# EAGLE design bad_style (EAGLE 9.6.2)
Assembly variants: Minimal, FullAwesome
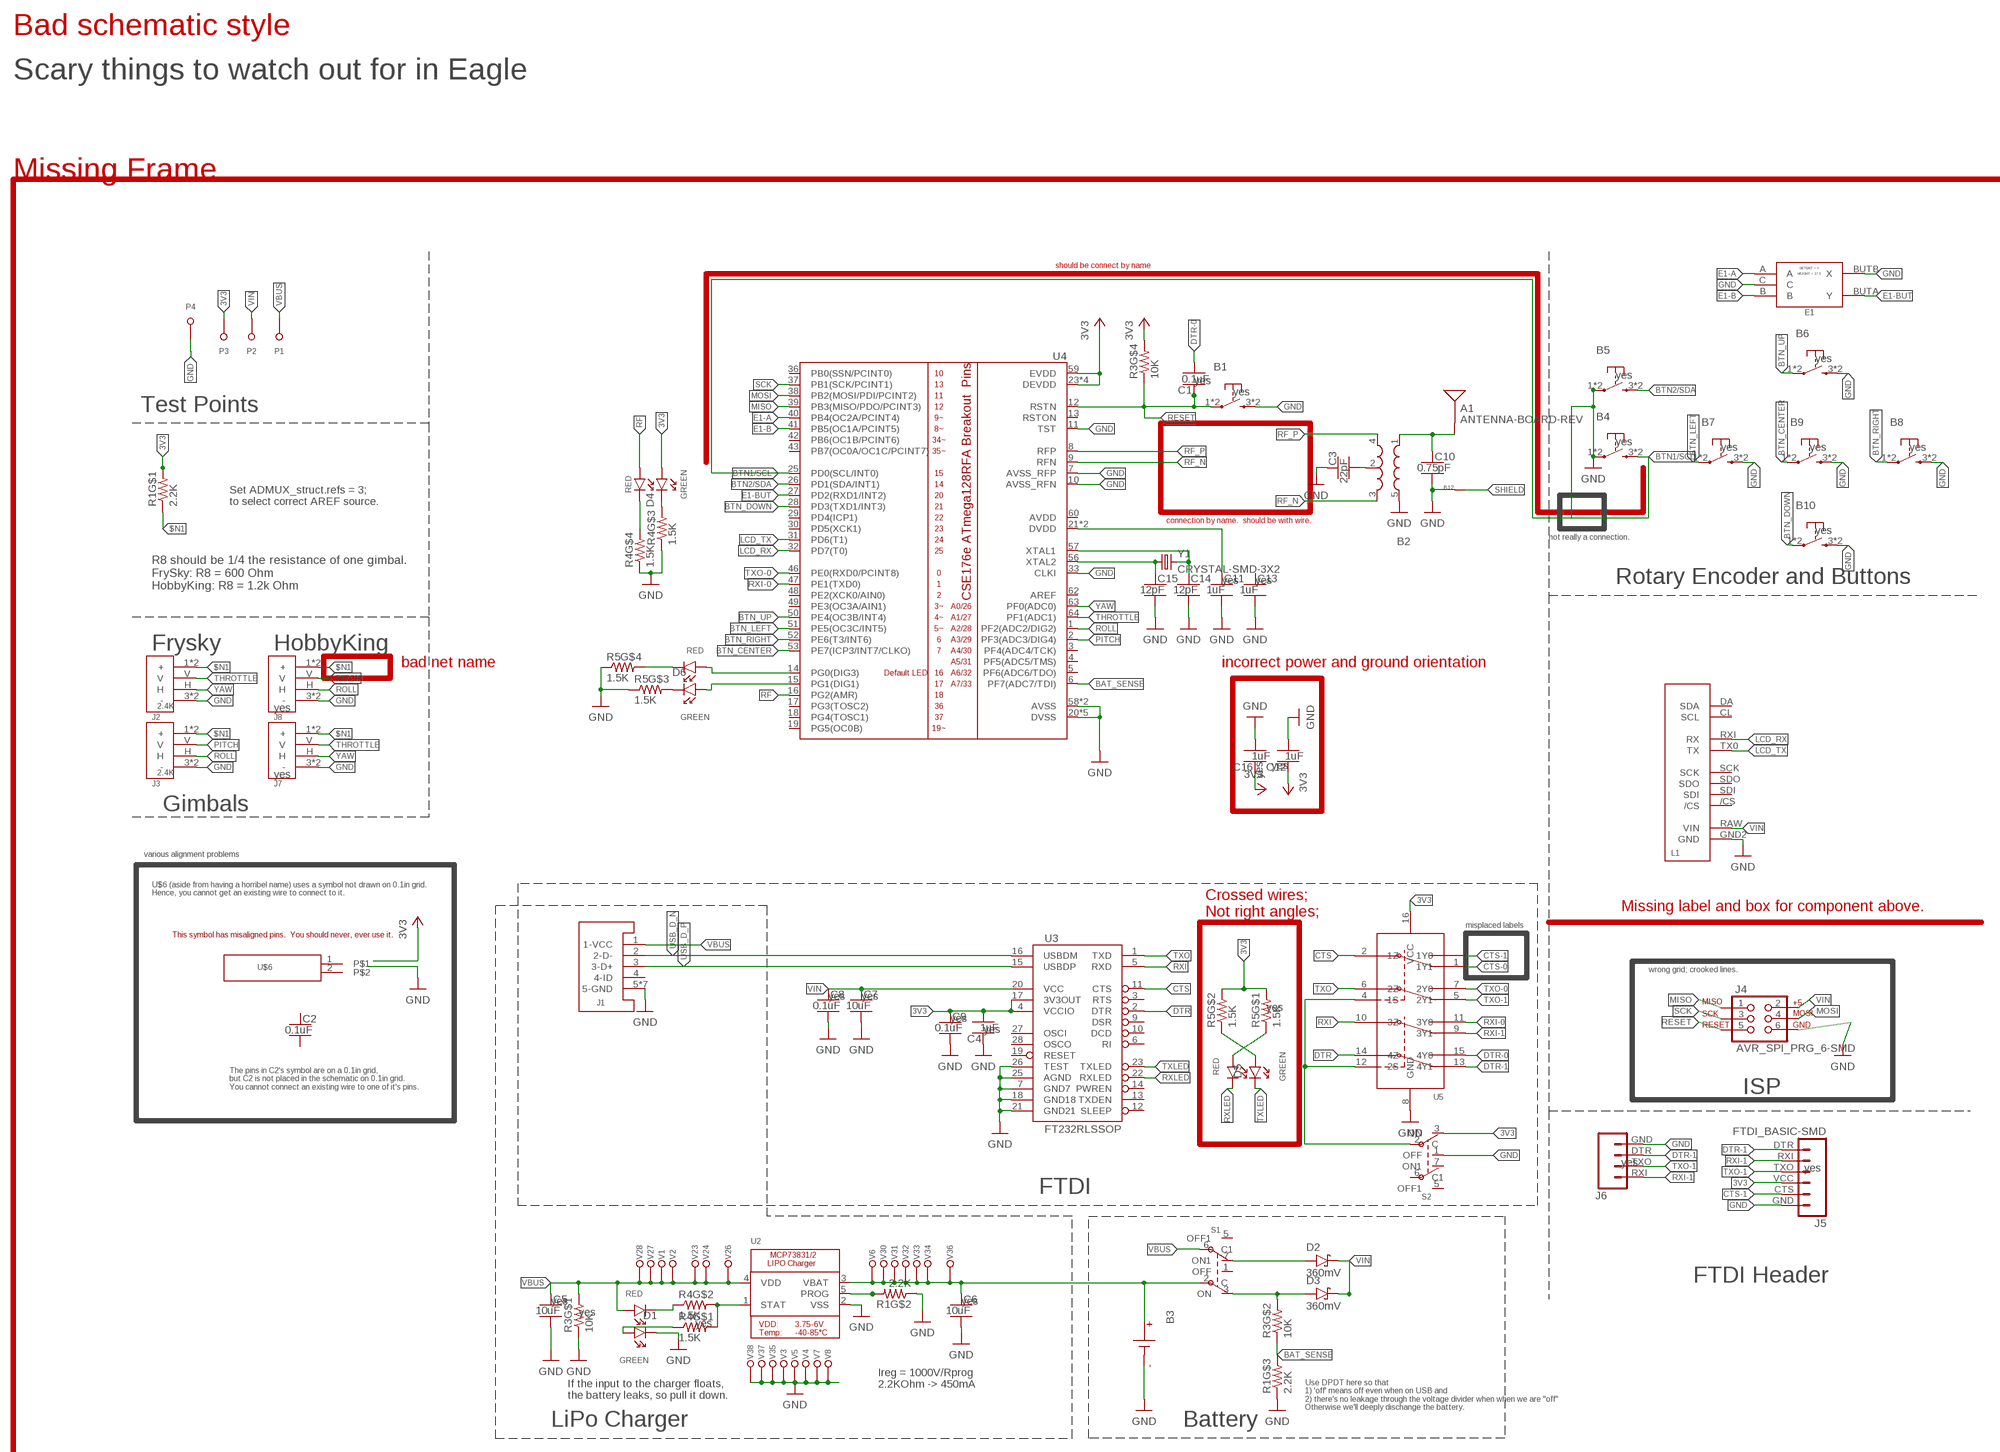
[diagram p0: schematic, sheet 1]

## Parts
A1  ANTENNA-BOARD-REV  [ANT_PCB_2.4GHZ_NRF8001_1.6MM_1OZ_REV]
B1  PUSHBUTTON_-4.5X4.5  [4.5MM_TACTILE_SWITCH_TL3305AF160QG]
B2  BALUN0805  [BALUN]
B3  BATTERY-SMD  [MOLEX-BATTERY-CONNECTOR-SMD-51005-2P]
B4  PUSHBUTTON_-4.5X4.5  [4.5MM_TACTILE_SWITCH_TL3305AF160QG]  (not fitted in variant Minimal)
B5  PUSHBUTTON_-4.5X4.5  [4.5MM_TACTILE_SWITCH_TL3305AF160QG]  (not fitted in variant Minimal)
B6  PUSHBUTTON_-4.5X4.5  [4.5MM_TACTILE_SWITCH_TL3305AF160QG]
B7  PUSHBUTTON_-4.5X4.5  [4.5MM_TACTILE_SWITCH_TL3305AF160QG]
B8  PUSHBUTTON_-4.5X4.5  [4.5MM_TACTILE_SWITCH_TL3305AF160QG]
B9  PUSHBUTTON_-4.5X4.5  [4.5MM_TACTILE_SWITCH_TL3305AF160QG]
B10  PUSHBUTTON_-4.5X4.5  [4.5MM_TACTILE_SWITCH_TL3305AF160QG]
B12  NET_BRIDGE  [NET_BRIDGE]
C1  0.1uF  CAPACITOR-NP_SMD-0603_CERAMIC-0.1UF  [CAPC1608X100]
C2  0.1uF  CAPACITOR-NP_SMD-0603_CERAMIC-0.1UF  [CAPC1608X100]
C3  22pF  CAPACITOR-NP_SMD-0603_CERAMIC-22PF  [CAPC1608X100]
C4  1uF  CAPACITOR-NP_SMD-0603_CERAMIC-1UF  [CAPC1608X100]
C5  10uF  CAPACITOR-NP_SMD-0603_CERAMIC-10UF  [CAPC1608X100]
C6  10uF  CAPACITOR-NP_SMD-0603_CERAMIC-10UF  [CAPC1608X100]
C7  10uF  CAPACITOR-NP_SMD-0603_CERAMIC-10UF  [CAPC1608X100]  (not fitted in variant Minimal)
C8  0.1uF  CAPACITOR-NP_SMD-0603_CERAMIC-0.1UF  [CAPC1608X100]  (not fitted in variant Minimal)
C9  0.1uF  CAPACITOR-NP_SMD-0603_CERAMIC-0.1UF  [CAPC1608X100]  (not fitted in variant Minimal)
C10  0.75pF  CAPACITOR-NP_SMD-0603_CERAMIC-0.75PF  [CAPC1608X100]
C11  1uF  CAPACITOR-NP_SMD-0603_CERAMIC-1UF  [CAPC1608X100]
C12  1uF  CAPACITOR-NP_SMD-0603_CERAMIC-1UF  [CAPC1608X100]
C13  1uF  CAPACITOR-NP_SMD-0603_CERAMIC-1UF  [CAPC1608X100]
C14  12pF  CAPACITOR-NP_SMD-0603_CERAMIC-12PF  [CAPC1608X100]
C15  12pF  CAPACITOR-NP_SMD-0603_CERAMIC-12PF  [CAPC1608X100]
C16  1uF  CAPACITOR-NP_SMD-0603_CERAMIC-1UF  [CAPC1608X100]
D1  LED-2X-GREEN/RED-1.6X1.5MM  [LED-2X-LITE-ON-1.6MMX1.5MM]
D2  360mV  DIODE-SCHOTTKY_-SMD-SOD123  [SODFL3516X96]
D3  360mV  DIODE-SCHOTTKY_-SMD-SOD123  [SODFL3516X96]
D4  LED-2X-GREEN/RED-1.6X1.5MM  [LED-2X-LITE-ON-1.6MMX1.5MM]
D5  LED-2X-GREEN/RED-1.6X1.5MM  [LED-2X-LITE-ON-1.6MMX1.5MM]  (not fitted in variant Minimal)
D6  LED-2X-GREEN/RED-1.6X1.5MM  [LED-2X-LITE-ON-1.6MMX1.5MM]
E1  ROTARY-ENCODER-W/BUTTON-BOURNS-PEC12R-4217F  [BOURNS-PEC12R]
J1  USB-MICROA-AMPHENOL-10118192-0001LF  [USB-MICROA-10118192-0001LF]  (not fitted in variant Minimal)
J2  2.4K  FRSKY-GIMBAL-FRYSKY  [JST-13-PTH]  (not fitted in variant Minimal)
J3  2.4K  FRSKY-GIMBAL-FRYSKY  [JST-13-PTH]  (not fitted in variant Minimal)
J4  AVR_SPI_PRG_6-SMD  [2X3-SMD]
J5  FTDI_BASIC-SMD  [FTDI-BASIC-SMD]
J6  FTDI-4PIN-RIGHT-ANGLE-SMD  [HEADER-2X2-0.1IN-MALE-RIGHT-ANGLE-SMD]
J7  FRSKY-GIMBAL-2X-SERVO-SMD  [2X-SERVO-SMD]
J8  FRSKY-GIMBAL-2X-SERVO-SMD  [2X-SERVO-SMD]
L1  SPARKFUN_SERLCD_SERIAL_REDUCED-SMD  [SPARKFUN_SERLCD_16X2_REDUCED_SMD]
P1  TEST-POINT  [TEST-POINT-KEYSTONE-5000]  (not fitted in variant Minimal)
P2  TEST-POINT  [TEST-POINT-KEYSTONE-5000]  (not fitted in variant Minimal)
P3  TEST-POINT  [TEST-POINT-KEYSTONE-5000]  (not fitted in variant Minimal)
P4  TEST-POINT  [TEST-POINT-KEYSTONE-5000]
R1  2.2K  RESISTOR-PACK-4X-2.2K  [RESCAXS50P200X100X45-8]
R3  10K  RESISTOR-PACK-4X-10K  [RESCAXS50P200X100X45-8]
R4  1.5K  RESISTOR-PACK-4X-1.5K  [RESCAXS50P200X100X45-8]
R5  1.5K  RESISTOR-PACK-4X-1.5K  [RESCAXS50P200X100X45-8]
S1  SWITCH-DPDT-300MA-6V-SMD  [JS202011JCQN]
S2  SWITCH-DPDT-300MA-6V-SMD  [JS202011JCQN]
U2  MCP73831T-2ACI/OT  MCP73831/2  [SOT23-5]
U3  FT232RLSSOP  [SSOP28DB]  (not fitted in variant Minimal)
U4  ATMEGA128RFA1  [QFN-64]
U5  DPDT-X2  [SOP65P640X110-16]  (not fitted in variant Minimal)
U$6  DONT_USE  [SCREW-TERMINAL-1X2-2.54MM]
V1  LOCKED-VIA-0.2  [VIA-0.2MM]
V2  LOCKED-VIA-0.2  [VIA-0.2MM]
V3  LOCKED-VIA-0.2  [VIA-0.2MM]
V4  LOCKED-VIA-0.2  [VIA-0.2MM]
V5  LOCKED-VIA-0.2  [VIA-0.2MM]
V6  LOCKED-VIA-0.2  [VIA-0.2MM]
V7  LOCKED-VIA-0.2  [VIA-0.2MM]
V8  LOCKED-VIA-0.2  [VIA-0.2MM]
V23  LOCKED-VIA-0.2  [VIA-0.2MM]
V24  LOCKED-VIA-0.2  [VIA-0.2MM]
V26  LOCKED-VIA-0.2  [VIA-0.2MM]
V27  LOCKED-VIA-0.2  [VIA-0.2MM]
V28  LOCKED-VIA-0.2  [VIA-0.2MM]
V30  LOCKED-VIA-0.2  [VIA-0.2MM]
V31  LOCKED-VIA-0.2  [VIA-0.2MM]
V32  LOCKED-VIA-0.2  [VIA-0.2MM]
V33  LOCKED-VIA-0.2  [VIA-0.2MM]
V34  LOCKED-VIA-0.2  [VIA-0.2MM]
V35  LOCKED-VIA-0.2  [VIA-0.2MM]
V36  LOCKED-VIA-0.2  [VIA-0.2MM]
V37  LOCKED-VIA-0.2  [VIA-0.2MM]
V38  LOCKED-VIA-0.2  [VIA-0.2MM]
Y1  CRYSTAL-SMD-3X2  [OSCCC320X250X85]

## Nets
3V3 [PWR]: C4.2 C9.1 C12.1 C16.1 D4.A1 J5.VCC P3.T R1.5 R3.8 R5.5 R5.6 S2.3(ON) U3.4(VCCIO) U3.17(3V3OUT) U4.23(DEVDD) U4.34(DEVDD) U4.44(DEVDD) U4.54(DEVDD) U4.59(EVDD) U5.16(VCC)
$N1: J2.1(+) J2.4(+) J3.1(+) J3.4(+) J7.1(+) J7.4(+) J8.1(+) J8.4(+) R1.4
ANTENNA [RFSIG]: A1.FEED(SIGNAL) B2.1(IN) C10.1
BAT_SENSE: R1.7 R3.3 U4.6(PF7(ADC7/TDI))
BCAP: B2.2(GND) C3.2
BPOS [HIGH-I]: B3.P C6.1 S1.2(C) U2.3(VBAT) V6.P1(N) V30.P1(N) V31.P1(N) V32.P1(N) V33.P1(N) V34.P1(N) V36.P1(N)
BTN1/SCL: B4.3 B4.4 U4.25(PD0(SCL/INT0))
BTN2/SDA: B5.3 B5.4 U4.26(PD1(SDA/INT1))
BTN_CENTER: B9.1 B9.2 U4.53(PE7(ICP3/INT7/CLKO))
BTN_DOWN: B10.1 B10.2 U4.28(PD3(TXD1/INT3))
BTN_LEFT: B7.1 B7.2 U4.51(PE5(OC3C/INT5))
BTN_RIGHT: B8.1 B8.2 U4.52(PE6(T3/INT6))
BTN_UP: B6.1 B6.2 U4.50(PE4(OC3B/INT4))
CLK_NEG: C15.1 U4.56(XTAL2) Y1.1
CLK_POS: C14.1 U4.57(XTAL1) Y1.3
CTS: U3.11(CTS) U5.2(1Z)
CTS-0: U5.3(1Y0)
CTS-1: J5.CTS U5.1(1Y1)
DTR: U3.2(DTR) U5.14(4Z)
DTR-0: C1.2 U5.15(4Y0)
DTR-1: J5.DTR J6.DTR U5.13(4Y1)
E1-A: E1.A U4.40(PB4(OC2A/PCINT4))
E1-B: E1.B U4.41(PB5(OC1A/PCINT5))
E1-BUT: E1.BUTA(Y) U4.27(PD2(RXD1/INT2))
GND [PWR]: B1.3 B1.4 B2.5(GND) B3.G2(N) B3.G3(N) B3.G(N) B4.1 B4.2 B5.1 B5.2 B6.3 B6.4 B7.3 B7.4 B8.3 B8.4 B9.3 B9.4 B10.3 B10.4 B12.P1 C3.1 C4.1 C5.2 C6.2 C7.2 C8.2 C9.2 C10.2 C11.2 C12.2 C13.2 C14.2 C15.2 C16.2 D1.C1 E1.BUTB(X) E1.C J1.5(5-GND) J1.6(5-GND) J1.7(5-GND) J1.8(5-GND) J1.9(5-GND) J1.10(5-GND) J1.11(5-GND) J2.3(-) J2.6(-) J3.3(-) J3.6(-) J4.6 J5.GND J6.GND J7.3(-) J7.6(-) J8.3(-) J8.6(-) L1.GND2(GND) P4.T R1.2 R1.3 R3.4 R4.1 R4.2 R5.1 R5.2 S2.1(OFF) U2.2(VSS) U3.7(GND7) U3.18(GND18) U3.21(GND21) U3.25(AGND) U3.26(TEST) U4.7(AVSS_RFP) U4.10(AVSS_RFN) U4.11(TST) U4.20(DVSS) U4.24(DVSS) U4.33(CLKI) U4.35(DVSS) U4.45(DVSS) U4.55(DVSS) U4.58(AVSS) U4.61(AVSS) U5.8(GND) V3.P1(N) V4.P1(N) V5.P1(N) V7.P1(N) V8.P1(N) V35.P1(N) V37.P1(N) V38.P1(N)
LCD_RX: L1.RXI(RX) U4.32(PD7(T0))
LCD_TX: L1.TX0(TX) U4.31(PD6(T1))
MISO: J4.1 U4.39(PB3(MISO/PDO/PCINT3))
MOSI: J4.4 U4.38(PB2(MOSI/PDI/PCINT2))
N$1: D1.A1 R4.4
N$2: D1.C2 R4.3
N$3: D5.A1 R5.3
N$4: D6.C2 R5.8
N$5: D6.C1 R5.7
N$6: D4.C1 R4.7
N$7: D5.A2 R5.4
N$8: D6.A2 U4.14(PG0(DIG3))
N$9: D6.A1 U4.15(PG1(DIG1))
N$11: R4.5 R4.6 U2.1(STAT)
N$12: R1.6 U2.5(PROG)
N$13: D4.C2 R4.8
N$14: D2.2(A) S1.7(ON1)
N$20: C11.1 U4.21(DVDD) U4.22(DVDD)
PITCH: J3.V J8.V U4.2(PF3(ADC3/DIG4))
PROG_SEL: S2.2(C) U5.4(1S) U5.12(2S)
RESET: B1.1 B1.2 C1.1 J4.5 R3.1 U4.12(RSTN)
RF: D4.A2 U4.16(PG2(AMR))
RF_N: B2.3(OUT2) U4.9(RFN)
RF_P: B2.4(OUT1) U4.8(RFP)
ROLL: J3.H J8.H U4.1(PF2(ADC2/DIG2))
RXI: U3.5(RXD) U5.10(3Z)
RXI-0: U4.47(PE1(TXD0)) U5.11(3Y0)
RXI-1: J5.RXI J6.RXI U5.9(3Y1)
RXLED: D5.C2 U3.22(RXLED)
SCK: J4.3 U4.37(PB1(SCK/PCINT1))
SHIELD: B12.P2
THROTTLE: J2.V J7.V U4.64(PF1(ADC1))
TXLED: D5.C1 U3.23(TXLED)
TXO: U3.1(TXD) U5.6(2Z)
TXO-0: U4.46(PE0(RXD0/PCINT8)) U5.7(2Y0)
TXO-1: J5.TXO J6.TXO U5.5(2Y1)
USB_D_N: J1.2(2-D-) U3.16(USBDM)
USB_D_P: J1.3(3-D+) U3.15(USBDP)
VBAT [HIGH-I]: D3.2(A) R3.6 S1.3(ON)
VBUS [HIGH-I]: C5.1 D1.A2 J1.1(1-VCC) P1.T R3.5 S1.6(C1) U2.4(VDD) V1.P1(N) V2.P1(N) V23.P1(N) V24.P1(N) V26.P1(N) V27.P1(N) V28.P1(N)
VIN [HIGH-I]: C7.1 C8.1 D2.1(C) D3.1(C) J4.2 L1.RAW(VIN) P2.T U3.20(VCC)
YAW: J2.H J7.H U4.63(PF0(ADC0))
Unconnected: C2.1 C2.2 C13.1 J1.4(4-ID) L1./CS L1.CL(SCL) L1.DA(SDA) L1.SCK L1.SDI L1.SDO R1.1 R1.8 R3.2 R3.7 S1.1(OFF) S1.5(OFF1) S2.5(OFF1) S2.6(C1) S2.7(ON1) U3.3(RTS) U3.6(RI) U3.9(DSR) U3.10(DCD) U3.12(SLEEP) U3.13(TXDEN) U3.14(PWREN) U3.19(RESET) U3.27(OSCI) U3.28(OSCO) U4.3(PF4(ADC4/TCK)) U4.4(PF5(ADC5/TMS)) U4.5(PF6(ADC6/TDO)) U4.13(RSTON) U4.17(PG3(TOSC2)) U4.18(PG4(TOSC1)) U4.19(PG5(OC0B)) U4.29(PD4(ICP1)) U4.30(PD5(XCK1)) U4.36(PB0(SSN/PCINT0)) U4.42(PB6(OC1B/PCINT6)) U4.43(PB7(OC0A/OC1C/PCINT7)) U4.48(PE2(XCK0/AIN0)) U4.49(PE3(OC3A/AIN1)) U4.60(AVDD) U4.62(AREF) U$6.1 U$6.2

## Notes on the sheet
- Bad schematic style
- Scary things to watch out for in Eagle
- Missing Frame
- should be connect by name
- Test Points
- connection by name.  should be with wire.
- Set ADMUX_struct.refs = 3;
  to select correct AREF source.
- not really a connection.
- Rotary Encoder and Buttons
- R8 should be 1/4 the resistance of one gimbal.
  FrySky: R8 = 600 Ohm
  HobbyKing: R8 = 1.2k Ohm
- Frysky | HobbyKing
- bad net name | incorrect power and ground orientation
- Gimbals
- various alignment problems
- U$6 (aside from having a horribel name) uses a symbol not drawn on 0.1in grid.  
  Hence, you cannot get an existing wire to connect to it.
- Missing label and box for component above.
- Crossed wires;
  Not right angles;
- misplaced labels
- wrong grid; crooked lines.
- The pins in C2's symbol are on a 0.1in grid,
  but C2 is not placed in the schematic on 0.1in grid.
  You cannot connect an existing wire to one of it's pins.
- ISP
- FTDI
- FTDI Header
- Ireg = 1000V/Rprog
  2.2KOhm -> 450mA
- If the input to the charger floats, 
  the battery leaks, so pull it down.
- Use DPDT here so that 
  1) 'off' means off even when on USB and 
  2) there's no leakage through the voltage divider when when we are "off"  
  Otherwise we'll deeply dischange the battery.
- LiPo Charger | Battery

## Library data of the parts
A1 = quadparts_prebuilt:ANTENNA: Single endded antenna.; CREATOR: Swanson; DESC: trace antenna; DIST: NA; DISTPN: NA; MFR: NA; MOUNTING: NONE; MPN: NA
B1 B4-B10 = quadparts_prebuilt:PUSHBUTTON_: "Tactile" or "clicky" button.; CREATOR: Swanson; DESC: SWITCH TACTILE SPST-NO 50MA 12V; DIST: DIGIKEY; DISTPN: EG5350CT-ND; MFR: E-Switch; MOUNTING: SMD; MPN: TL3305AF160QG; SUBSTITUTE_OK: yes
B2 = quadparts_prebuilt:BALUN: A balun to convert differential radio-frequency outputs from the microcontroller into a single-ended driver for the antenna.; CREATOR: Swanson; DATASHEET: http://katalog.we-online.de/pbs/datasheet/748421245.pdf; DESC: BALUN 2.4GHZ-2.5GHZ 50/100 0805; DIST: Digikey; DISTPN: 732-2230-1-ND; MFR: Wurth Electronics Inc.; MOUNTING: SMD; MPN: 748421245; PACKAGE: 0805; PRICE: 2.63; REVIEWER: Swanson
B3 = quadparts_prebuilt:BATTERY: Connections for a battery.; CREATOR: Swanson; DESC: Surface mount battery connector; DIST: ALIBABA; DISTPN: https://www.alibaba.com/product-detail/Molex-51005-51006-2-pin-female_60863668004.html?spm=a2700.7724857.normalList.97.20ef28e64nZnNK; MFR: UNKNOWN; MOUNTING: SMD; MPN: UNKNOWN
B12 = custom:NET_BRIDGE; CREATOR: Michael Gonzalez; DESC: NA; DIST: NA; DISTPN: NA; MFR: None; MFRPN: None; POPULATE: No
C1 C8 C9 = quadparts_prebuilt:CAPACITOR-NP_: Nonpolarized capacitor; CREATOR: Swanson; DESC: CAP CER 0.1UF 10V X7R 0603; DIST: Digikey; DISTPN: 399-1095-1-ND; MFR: KEMET; MOUNTING: SMD; MPN: C0603C104K8RACTU; PACKAGE: 0603; SUBSTITUTE_OK: yes
C2 = quadparts_prebuilt:CAPACITOR-NP_: Nonpolarized capacitor; CREATOR: Swanson; DESC: CAP CER 0.1UF 10V X7R 0603; DIST: Digikey; DISTPN: 399-1095-1-ND; MFR: KEMET; MOUNTING: SMD; MPN: C0603C104K8RACTU; PACKAGE: 0603
C3 = quadparts_prebuilt:CAPACITOR-NP_: Nonpolarized capacitor; CREATOR: Swanson; DESC: CAP CER 22PF 6.3V NP0 0603; DIST: Digikey; DISTPN: 478-11384-1-ND; MFR: AVX Corporation; MOUNTING: SMD; MPN: 06036A220KAT2A; PACKAGE: 0603
C4 C11-C13 C16 = quadparts_prebuilt:CAPACITOR-NP_: Nonpolarized capacitor; CREATOR: Swanson; DESC: CAP CER 1UF 10V X5R 0603; DIST: Digikey; DISTPN: 1276-1182-1-ND; MFR: Samsung Electro-Mechanics; MOUNTING: SMD; MPN: CL10A105KP8NNNC; PACKAGE: 0603; SUBSTITUTE_OK: yes
C5-C7 = quadparts_prebuilt:CAPACITOR-NP_: Nonpolarized capacitor; CREATOR: Swanson; DESC: CAP CER 10UF 6.3V X5R 0603; DIST: Digikey; DISTPN: 1276-1119-1-ND; MFR: Samsung Electro-Mechanics; MOUNTING: SMD; MPN: CL10A106MQ8NNNC; PACKAGE: 0603; SUBSTITUTE_OK: yes
C10 = quadparts_prebuilt:CAPACITOR-NP_: Nonpolarized capacitor; CREATOR: Swanson; DESC: CAP CER 0.75PF 50V NPO 0603; DIST: Digikey; DISTPN: 311-3843-1-ND; MFR: Yageo; MOUNTING: SMD; MPN: CC0603BRNPO9BNR75; PACKAGE: 0603
C14 C15 = quadparts_prebuilt:CAPACITOR-NP_: Nonpolarized capacitor; CREATOR: Swanson; DESC: CAP CER 12PF 10V C0G/NP0 0603; DIST: Digikey; DISTPN: 720-1655-1-ND; MFR: Vishay Vitramon; MOUNTING: SMD; MPN: VJ0603A120FXQCW1BC; PACKAGE: 0603
D1 D4-D6 = RemoteParts:LED-2X; COLOR1: RED; COLOR2: GREEN; CREATOR: Swanson; DESC: LED GREEN/RED CLEAR CHIP SMD; DIST: DIGIKEY; DISTPN: 160-2252-1-ND; MFR: Lite-On Inc.; MOUNTING: SMD; MPN: LTST-C195TGKRKT; PACKAGE: 4SMD
D2 D3 = quadparts_prebuilt:DIODE-SCHOTTKY_: Schottky diode; CREATOR: Swanson; DESC: DIODE SCHOTTKY 30V 1.5A SFLAT; DIST: Digikey; DISTPN: CRS08QMCT-ND; MFR: Toshiba Semiconductor and Storage; MOUNTING: SMD; MPN: CRS08(TE85L,Q,M); REVIEWER: Swanson
E1 = RemoteParts:ROTARY-ENCODER-W/BUTTON; AUX1DIST: DIGIKEY; AUX1DISTPN: 1722-1241-ND; CREATOR: Swanson; DETENT: Y; DIST: DIGIKEY; DISTPN: PEC12R-4217F-S0024-ND; HEIGHT: 17.5; MOUNTING: TH; POPULATE: NO
J1 = RemoteParts:USB; CREATOR: Swanson; DESC: CONN RCPT USB2.0 MICRO B SMD R/A; DIST: DIGIKEY; DISTPN: 609-4613-1-ND; MFR: Amphenol ICC (FCI); MOUNTING: SMD; MPN: 10118192-0001LF
J2 = RemoteParts:FRSKY-GIMBAL; CREATOR: Swanson; DESC: CONN HEADER VERT 12POS 2MM; DIST: Digikey; DISTPN: A100106-ND; MFR: TE Connectivity AMP Connectors; MOUNTING: TH; MPN: 1-1735446-2; POPULATE: NO
J3 = RemoteParts:FRSKY-GIMBAL; CREATOR: Swanson; DESC: CONN HEADER VERT 12POS 2MM; DIST: Digikey; DISTPN: A100106-ND; MFR: TE Connectivity AMP Connectors; MOUNTING: TH; MPN: 1-1735446-2; POPULATE: NO; SPICEPREFIX: E
J4 = quadparts_prebuilt:AVR_SPI_PRG_6: AVR ISP 6 Pin This is the in-system programming (ISP) connector for Atmel Microcontrollers programming.; CREATOR: Swanson; DESC: CONN HEADER SMD 6POS 2.54MM; DIST: Digikey; DISTPN: 609-3487-2-ND; MFR: Amphenol ICC (FCI); MOUNTING: SMD; MPN: 95278-101A06LF
J5 = quadparts_prebuilt:FTDI_BASIC: FTDI (USB-serial converter) header bins with labels.; CREATOR: Swanson; DESC: CONN HEADER SMD R/A 6POS 2.54MM; DIST: DIGIKEY; DISTPN: 952-3235-ND; LEFT_PIN: B; MFR: Harwin Inc.; MOUNTING: SMD; MPN: M20-8890645; RIGHT_PIN: G; SUBSTITUTE_OK: yes
J6 = quadparts_prebuilt:FTDI-4PIN; CREATOR: Swanson; DESC: CONN HEADER SMD R/A 4POS 2.54MM; DIST: DIGIKEY; DISTPN: SAM15344-ND; MFR: Samtec Inc.; MOUNTING: SMD; MPN: TSM-102-01-L-DH; SUBSTITUTE_OK: yes
J7 J8 = RemoteParts:FRSKY-GIMBAL; CREATOR: Swanson; DESC: CONN HEADER SMD R/A 6POS 2.54MM; DIST: DIGIKEY; DISTPN: 952-3235-ND; MFR: Harwin Inc.; MOUNTING: SMD; MPN: M20-8890645; SUBSTITUTE_OK: yes
L1 = RemoteParts:SPARKFUN_SERLCD_SERIAL_REDUCED; AUX1DIST: Sparkfun; AUX1DISTPN: LCD-14072; AUX1MFR: Sparkfun; AUX1MPN: LCD-14072; CREATOR: Swanson; DESC: 10 Position Header, Top or Bottom Entry Connector Surface Mount; DIST: Digikey; DISTPN: S5641-ND; MFR: Sullins Connector Solutions; MOUNTING: SMD; MPN: NPPC101KFXC-RC
P1 = RemoteParts:TEST-POINT; CREATOR: Swanson; DESC: PC TEST POINT MINIATURE BLACK; DIST: DIGIKEY; DISTPN: 36-5001-ND; MFR: Keystone Electronics; MOUNTING: TH; MPN: 5001; POPULATE: no
P2-P4 = RemoteParts:TEST-POINT; CREATOR: Swanson; DESC: PC TEST POINT MINIATURE BLACK; DIST: DIGIKEY; DISTPN: 36-5001-ND; MFR: Keystone Electronics; MOUNTING: TH; MPN: 5001; POPULATE: NO
R1 = quadparts_prebuilt:RESISTOR-PACK-4X; CREATOR: Swanson; DESC: RES ARRAY 4 RES 220 OHM 0804; DIST: DIGIKEY; DISTPN: Y10222CT-ND; MFR: Panasonic Electronic Components; MOUNTING: SMD; MPN: EXB-N8V221JX; SUBSTITUTE_OK: yes
R3 = quadparts_prebuilt:RESISTOR-PACK-4X; CREATOR: Swanson; DESC: RES ARRAY 4 RES 10K OHM 0804; DIST: DIGIKEY; DISTPN: Y10103CT-ND; MFR: Panasonic Electronic Components; MOUNTING: SMD; MPN: EXB-N8V103JX; PACKAGE: 0804; SUBSTITUTE_OK: yes
R4 R5 = quadparts_prebuilt:RESISTOR-PACK-4X; CREATOR: Swanson; DESC: RES ARRAY 4 RES 1.5K OHM 0804; DIST: DIGIKEY; DISTPN: Y10152CT-ND; MFR: Panasonic Electronic Components; MOUNTING: SMD; MPN: EXB-N8V152JX; SUBSTITUTE_OK: yes
S1 S2 = RemoteParts:SWITCH-DPDT; CREATOR: Swanson; DESC: SWITCH SLIDE DPDT 300MA 6V; DIST: DIGIKEY; DISTPN: CKN10723CT-ND; MFR: C&K; MOUNTING: SMD; MPN: JS202011JCQN
U2 = RemoteParts:MCP73831/2: MCP73831/2 LIPO Charger VDD: 3.75 - 6V Temp -40 - 85°C Programmable Charge Rate: 15-500mA NOTE: STAT is a tri-state logic output on the MCP73831 and an open-drain output on the MCP73832. SOT23-5 with 4.2V output and tri-state logic on STAT = MCP73831T-2ACI/OT; CREATOR: Adafruit; DESC: IC CONTROLLR LI-ION 4.2V SOT23-5; DIST: DIGIKEY; DISTPN: MCP73831T-2ACI/OTCT-ND; MFR: Microchip Technology; MOUNTING: SMD; MPN: MCP73831T-2ACI/OT; PACKAGE: SOT23-5
U3 = RemoteParts:FT232RL: USB UART FT232RL 4th Generation USB UART (USB <-> Serial) Controller. Spark Fun Electronics SKU : COM-00650; CREATOR: Swanson; DESC: IC USB FS SERIAL UART 28-SSOP; DIST: DIGIKEY; DISTPN: 768-1007-1-ND; MFR: FTDI; MOUNTING: SMD; MPN: FT232RL-REEL
U4 = quadparts_prebuilt:ATMEGA128RFA1: ATmega128RFA1 8-bit AVR Microcontroller with Low Power 2.4GHz Transceiver for ZigBee and IEEE 802.15.4; CREATOR: Swanson; DATASHEET: http://www.atmel.com/Images/Atmel-8266-MCU_Wireless-ATmega128RFA1_Datasheet.pdf; DESC: IC RF TXRX+MCU 802.15.4 64VFQFN; DIST: Digikey; DISTPN: ATMEGA128RFA1-ZU-ND; MFR: Microchip Technology; MOUNTING: SMD; MPN: ATMEGA128RFA1-ZU; PACKAGE: QFN; PRICE: 10.21; REVIEWER: Swanson
U5 = RemoteParts:DPDT-X2; CREATOR: Swanson; DESC: IC ANALOG SWITCH DPDT 16TSSOP; DIST: DIGIKEY; DISTPN: 568-5300-1-ND; MFR: NXP USA Inc.; MOUNTING: SMD; MPN: NX3L2467PW,118
U$6 = RemoteParts:DONT_USE
V1-V8 V23 V24 V26-V28 V30-V38 = quadparts_prebuilt:LOCKED-VIA: A via that be removed via ripup.; CREATOR: Swanson; DIST: NA; DISTPN: NA; MFR: NA; MFRPN: NA; MOUNTING: NONE; POPULATE: NO
Y1 = quadparts_prebuilt:CRYSTAL: Crystals to provide clock references for microcontrollers, etc.; CREATOR: Swanson; DESC: CRYSTAL 16.0000MHZ 18PF SMD; DIST: DIGIKEY; DISTPN: 535-9134-1-ND; MFR: Abracon LLC; MOUNTING: SMD; MPN: ABM8-16.000MHZ-B2-T

## Net classes
1 HIGH-I: width 0.508 mm, drill 0.381 mm
2 RFSIG: width 1.016 mm

## Board
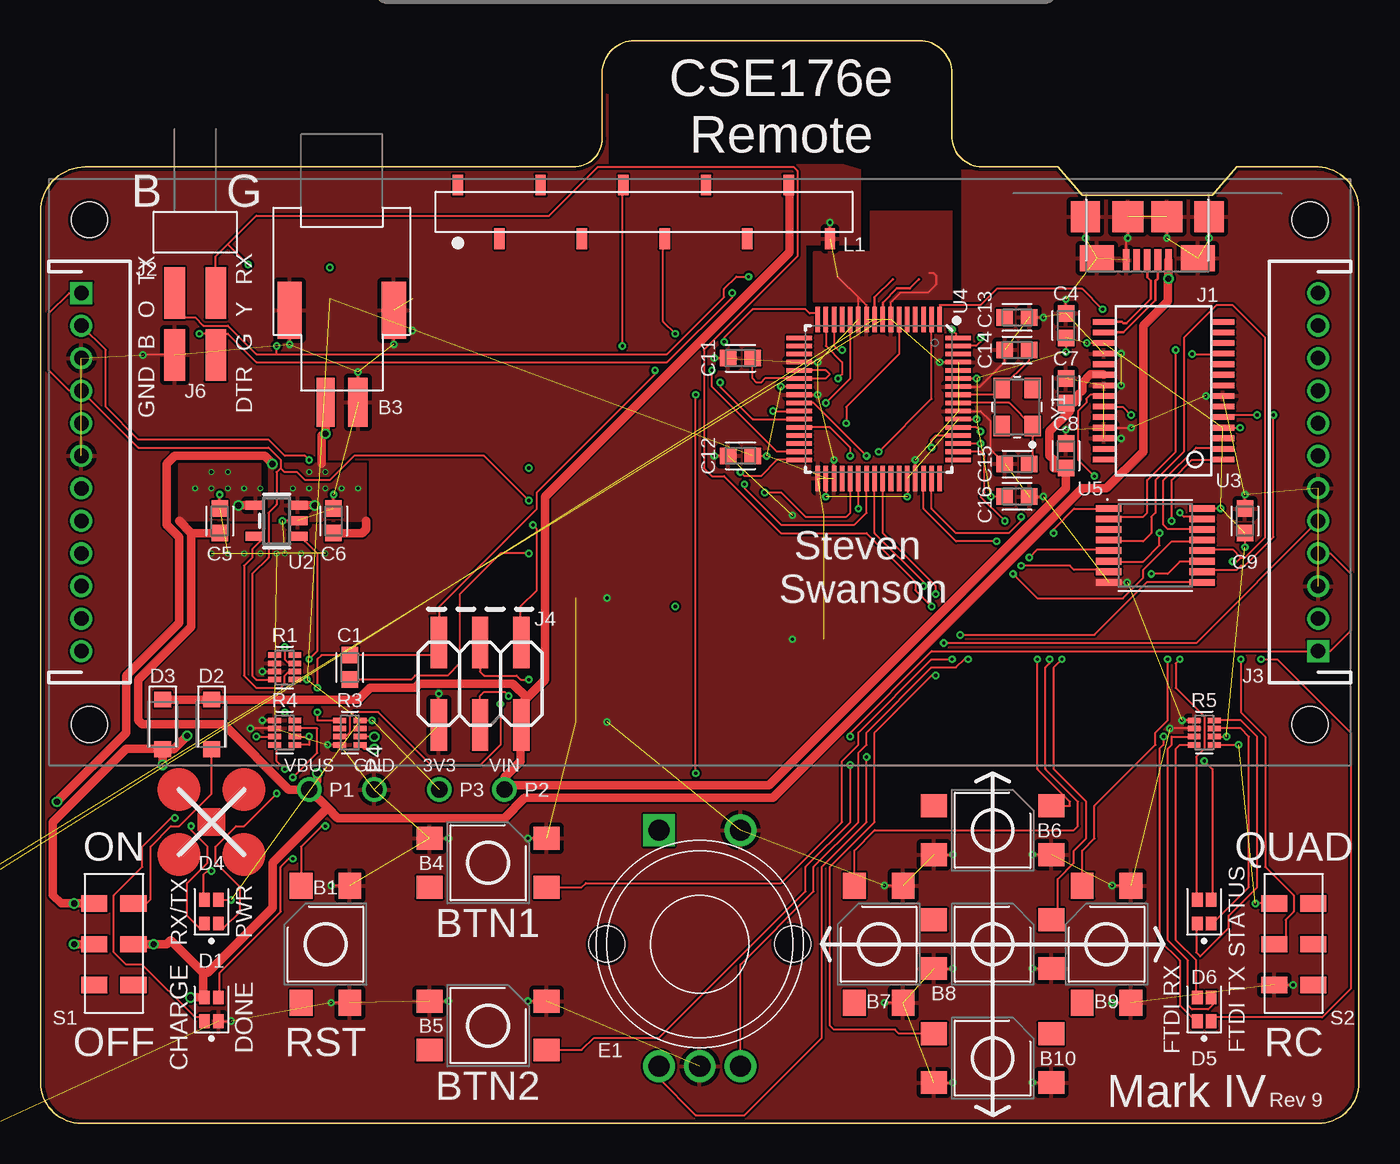
[diagram p1: board, top side]
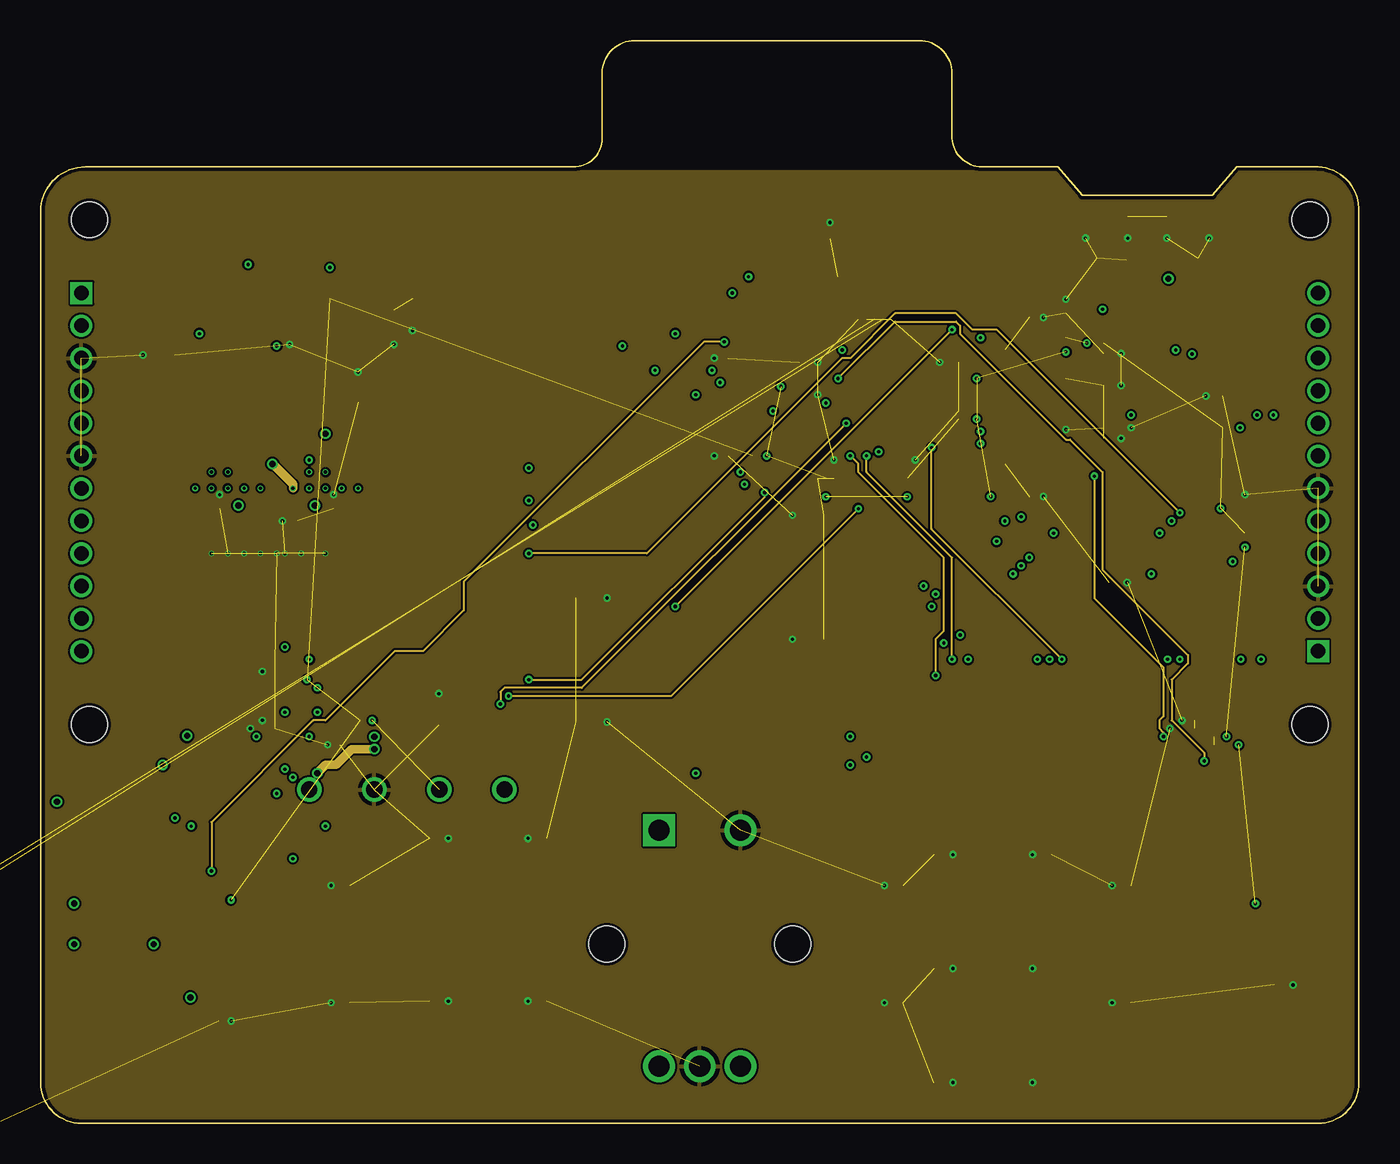
[diagram p2: board, inner layer Route2]
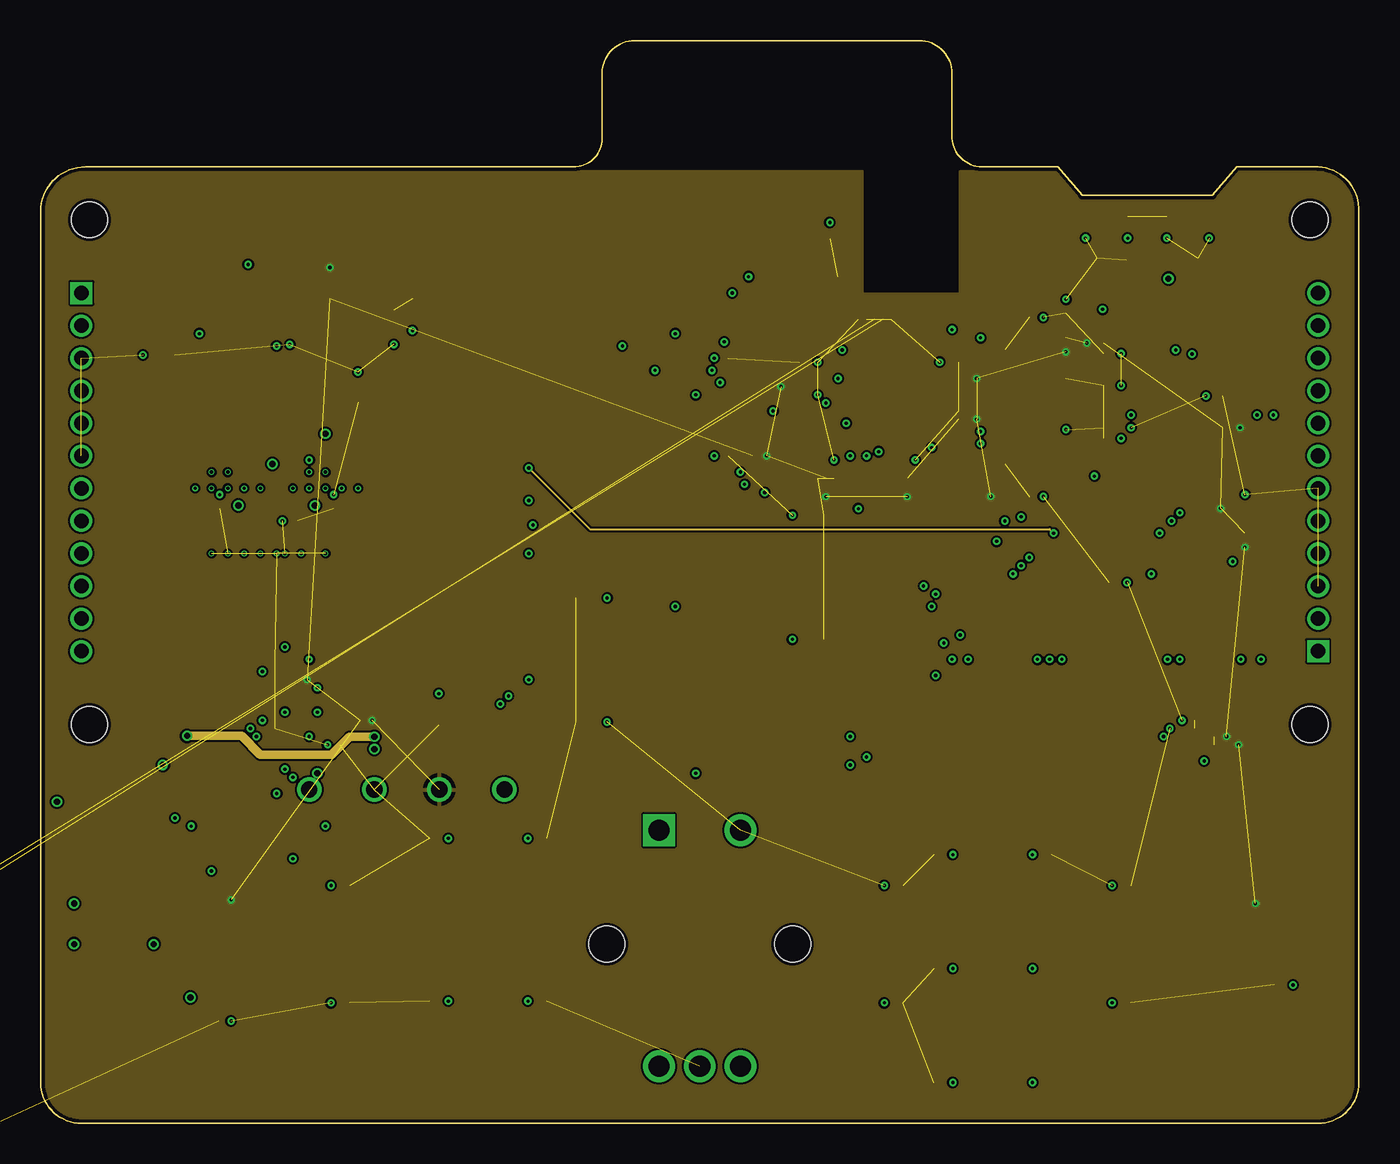
[diagram p3: board, inner layer Route15]
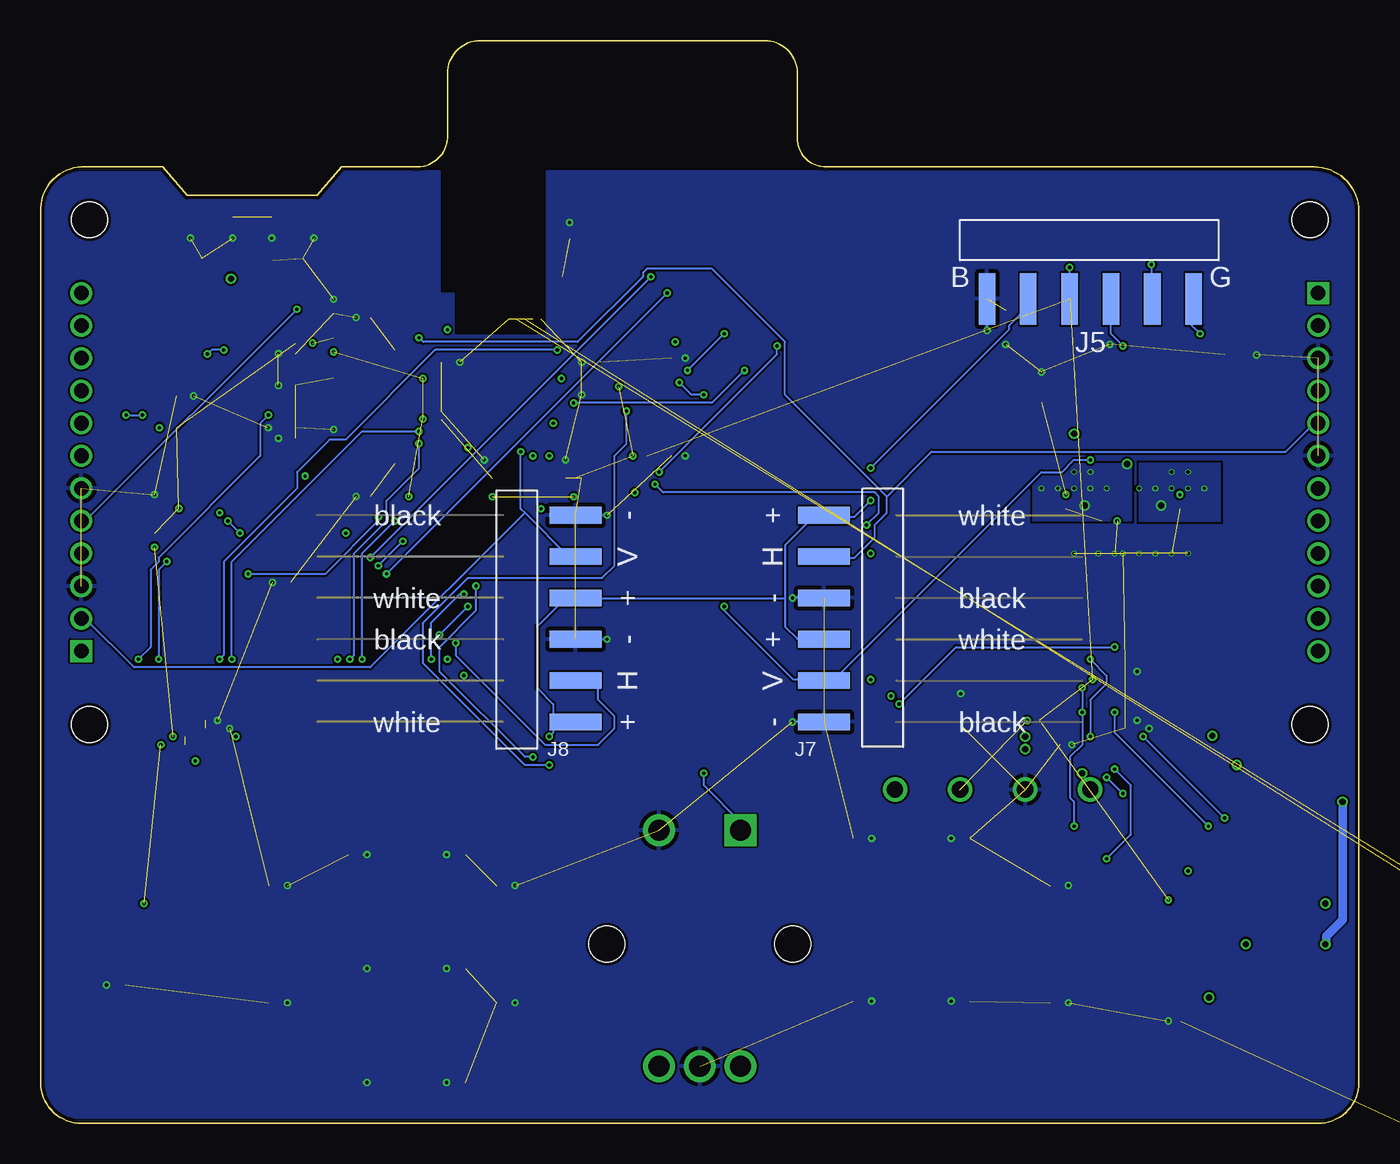
[diagram p4: board, bottom side, seen from below]

Size 81 x 66.5 mm. Coordinates in mm from the lower left corner, seen from the top.
Outline: 2.5,0 78.5,0 arc90 81,2.5 81,56 arc90 78.5,58.75 73.5,58.75 72,57 64,57 62.5,58.75 58,58.75 arc-90 56,60.5 56,64.5 arc90 54,66.5 36.5,66.5 arc90 34.5,64.5 34.5,60.5 arc-90 32.75,58.75 2.75,58.75 arc90 0,56 0,2.5 arc90 2.5,0
Copper layers (1*2*15*16): Top 0.035559375mm / dielectric 1.501140625mm / Route2 0.035559375mm / dielectric 0.149859375mm / Route15 0.035559375mm / dielectric 0.200659375mm / Bottom 0.035559375mm
Design rules "jlcpcb-4layer-5mil-small-cream": minimum track width 5mil, minimum drill 0.2mm, track to track 5mil, track to pad 5mil, pad to pad 5mil, via to via 5mil, smd to smd 5mil, copper to edge 0.2mm, drill to drill 10mil, minimum pad ring 3mil, minimum via ring 5mil, stop-mask expansion 3mil, vias tented up to drill 0.45mm, thermal gap 10mil
tRestrict: 12 lines
bRestrict: area 35,48.5 to 55.5,66.5

### Footprints (pad centres in the part's own frame; a part is rotated, then mirrored left to right if it is on the bottom)
ANT_PCB_2.4GHZ_NRF8001_1.6MM_1OZ_REV = smd 1.27 x 1.27: FEED 0,0; TESTPOINT 8.169,17.605
4.5MM_TACTILE_SWITCH_TL3305AF160QG = smd 1.6 x 1.4: 1 -3.6,-1.5; 2 3.6,-1.5; 3 -3.6,1.5; 4 3.6,1.5
BALUN = smd 0.35 x 1: 1 -0.65,-0.8; 2 0,-0.8; 3 0.65,-0.8; 4 0.65,0.8; 5 0,0.8; 6 -0.65,0.8
MOLEX-BATTERY-CONNECTOR-SMD-51005-2P = smd 1.2 x 3: G -1,5.2 | smd 1.5 x 3.5: G2 -3.2,-0.45; G3 3.2,-0.45 | smd 1.1 x 3: P 1,5.2
NET_BRIDGE = drill 0.2 pad 0.813: P1 -0.5,0; P2 0.5,0
CAPC1608X100 = smd 1.009 x 1.015: 1 -0.753,0; 2 0.753,0
LED-2X-LITE-ON-1.6MMX1.5MM = smd 0.85 x 0.65: A1 -0.725,0.425; A2 -0.725,-0.425; C1 0.725,0.425; C2 0.725,-0.425
SODFL3516X96 = smd 0.962 x 1.029: 1 -1.525,0; 2 1.525,0
BOURNS-PEC12R = drill 1.3: A -2.5,-7.5; B 2.5,-7.5; BUTB 2.5,7; C 0,-7.5 | drill 1.3 square: BUTA -2.5,7 | hole 2.2: -5.7,0; 5.7,0
FRSKY-TARANIS-GIMBAL = hole 2.2: -27,-27; -27,27; -27,27; 27,-27; 27,27
USB-MICROA-10118192-0001LF = smd 0.4 x 1.35: 1 -1.3,0; 2 -0.65,0; 3 0,0; 4 0.65,0; 5 1.3,0 | smd 2.1 x 1.6: 6 3.1,-0.125; 7 -3.1,-0.125 | smd 1.8 x 1.9: 8 -3.8,-2.675; 11 3.8,-2.675 | smd 1.9 x 1.9: 9 1.2,-2.675; 10 -1.2,-2.675
JST-13-PTH = drill 0.9 square: 1 -2,0 | drill 0.9: 3 2,0; 4 4,0; 6 8,0; 7 10,0; 8 12,0; 9 14,0; 10 16,0; 11 18,0; 12 20,0; H 6,0; V 0,0
2X3-SMD = smd 1 x 3.15: 1 -2.54,-2.54; 2 -2.54,2.54; 3 0,-2.54; 4 0,2.54; 5 2.54,-2.54; 6 2.54,2.54
FTDI-BASIC-SMD = smd 1.02 x 3.17: CTS -3.81,0.635; DTR 6.35,0.635; GND -6.35,0.635; RXI 3.81,0.635; TXO 1.27,0.635; VCC -1.27,0.635
HEADER-2X2-0.1IN-MALE-RIGHT-ANGLE-SMD = smd 1.27 x 3.18: DTR 1.27,-8.806; GND -1.27,-8.806; RXI 1.27,-4.996; TXO -1.27,-4.996
2X-SERVO-SMD = smd 1.02 x 3.17: 1 -6.35,0.635; 3 -1.27,0.635; 4 1.27,0.635; 6 6.35,0.635; H -3.81,0.635; V 3.81,0.635
SPARKFUN_SERLCD_16X2_REDUCED_SMD = smd 0.635 x 1.27: /CS -7.24,14.336; CL 0.38,17.636; DA 2.92,14.336; GND2 8,14.336; RAW 5.46,17.636; RXI -4.7,17.636; SCK -14.86,17.636; SDI -9.78,17.636; SDO -12.32,14.336; TX0 -2.16,14.336 | hole 2.2: -37.5,-15.5; -37.5,15.5; 37.5,-15.5; 37.5,15.5
TEST-POINT-KEYSTONE-5000 = drill 1: T 0,0
RESCAXS50P200X100X45-8 = smd 0.79 x 0.339: 1 -0.62,0.75; 2 -0.62,0.25; 3 -0.62,-0.25; 4 -0.62,-0.75; 5 0.62,-0.75; 6 0.62,-0.25; 7 0.62,0.25; 8 0.62,0.75
JS202011JCQN = smd 1 x 1.6: 1 -2.5,1.2; 2 0,1.2; 3 2.5,1.2; 5 -2.5,-1.2; 6 0,-1.2; 7 2.5,-1.2
SOT23-5 = smd 0.55 x 1.2: 1 -0.95,-1.3; 2 0,-1.3; 3 0.95,-1.3; 4 0.95,1.3; 5 -0.95,1.3
SSOP28DB = smd 0.348 x 1.397: 1 -4.225,-3.656; 2 -3.575,-3.656; 3 -2.925,-3.656; 4 -2.275,-3.656; 5 -1.625,-3.656; 6 -0.975,-3.656; 7 -0.325,-3.656; 8 0.325,-3.656; 9 0.975,-3.656; 10 1.625,-3.656; 11 2.275,-3.656; 12 2.925,-3.656; 13 3.575,-3.656; 14 4.225,-3.656; 15 4.225,3.656; 16 3.575,3.656; 17 2.925,3.656; 18 2.275,3.656; 19 1.625,3.656; 20 0.975,3.656; 21 0.325,3.656; 22 -0.325,3.656; 23 -0.975,3.656; 24 -1.625,3.656; 25 -2.275,3.656; 26 -2.925,3.656; 27 -3.575,3.656; 28 -4.225,3.656
QFN-64 = smd 1.562 x 0.28: 1 -4.881,3.75; 2 -4.881,3.25; 3 -4.881,2.75; 4 -4.881,2.25; 5 -4.881,1.75; 6 -4.881,1.25; 7 -4.881,0.75; 8 -4.881,0.25; 9 -4.881,-0.25; 10 -4.881,-0.75; 11 -4.881,-1.25; 12 -4.881,-1.75; 13 -4.881,-2.25; 14 -4.881,-2.75; 15 -4.881,-3.25; 16 -4.881,-3.75; 33 4.881,-3.75; 34 4.881,-3.25; 35 4.881,-2.75; 36 4.881,-2.25; 37 4.881,-1.75; 38 4.881,-1.25; 39 4.881,-0.75; 40 4.881,-0.25; 41 4.881,0.25; 42 4.881,0.75; 43 4.881,1.25; 44 4.881,1.75; 45 4.881,2.25; 46 4.881,2.75; 47 4.881,3.25; 48 4.881,3.75 | smd 0.28 x 1.562: 17 -3.75,-4.881; 18 -3.25,-4.881; 19 -2.75,-4.881; 20 -2.25,-4.881; 21 -1.75,-4.881; 22 -1.25,-4.881; 23 -0.75,-4.881; 24 -0.25,-4.881; 25 0.25,-4.881; 26 0.75,-4.881; 27 1.25,-4.881; 28 1.75,-4.881; 29 2.25,-4.881; 30 2.75,-4.881; 31 3.25,-4.881; 32 3.75,-4.881; 49 3.75,4.881; 50 3.25,4.881; 51 2.75,4.881; 52 2.25,4.881; 53 1.75,4.881; 54 1.25,4.881; 55 0.75,4.881; 56 0.25,4.881; 57 -0.25,4.881; 58 -0.75,4.881; 59 -1.25,4.881; 60 -1.75,4.881; 61 -2.25,4.881; 62 -2.75,4.881; 63 -3.25,4.881; 64 -3.75,4.881
SOP65P640X110-16 = smd 1.572 x 0.407: 1 -2.872,2.275; 2 -2.872,1.625; 3 -2.872,0.975; 4 -2.872,0.325; 5 -2.872,-0.325; 6 -2.872,-0.975; 7 -2.872,-1.625; 8 -2.872,-2.275; 9 2.872,-2.275; 10 2.872,-1.625; 11 2.872,-0.975; 12 2.872,-0.325; 13 2.872,0.325; 14 2.872,0.975; 15 2.872,1.625; 16 2.872,2.275
SCREW-TERMINAL-1X2-2.54MM = drill 1.1 square: 1 -1.27,0 | drill 1.1: 2 1.27,0
VIA-0.2MM = drill 0.2 pad 0.3: P1 0,0
OSCCC320X250X85 = smd 1.262 x 1.012: 1 -1.175,-0.95; 2 1.175,-0.95; 3 1.175,0.95; 4 -1.175,0.95

### Placement (x,y rotation side)
A1  -116.5,-64 0 top  (outside the outline)
B1  17.5,11 270 top
B2  -105.5,-48 0 top  (outside the outline)
B3  18.5,49.5 180 top
B4  27.5,16 180 top
B5  27.5,6 180 top
B6  58.5,18 180 top
B7  51.5,11 270 top
B8  58.5,11 180 top
B9  65.5,11 270 top
B10  58.5,4 180 top
B12  -106.5,-67 0 top  (outside the outline)
C1  19,28 270 top
C2  -108.5,-42 0 top  (outside the outline)
C3  -110.5,-68 0 top  (outside the outline)
C4  63,49 270 top
C5  11,37 90 top
C6  18,37 90 top
C7  63,45 90 top
C8  63,41 90 top
C9  74,37 90 top
C10  -115.5,-68 0 top  (outside the outline)
C11  43,47 180 top
C12  43,41 180 top
C13  60,49.5 0 top
C14  60,47.5 180 top
C15  60,40.5 180 top
C16  60,38.5 0 top
D1  10.5,7 270 top
D2  10.5,24.5 270 top
D3  7.5,24.5 270 top
D4  10.5,13 270 top
D5  71.5,7 270 top
D6  71.5,13 270 top
E1  40.5,11 0 top
E$1  [FRSKY-TARANIS-GIMBAL]  -39.5,30 0 top  (outside the outline)
E$2  [FRSKY-TARANIS-GIMBAL]  120.5,30 180 top  (outside the outline)
J1  68,53 180 top
J2  2.5,49 270 top
J3  78.5,31 90 top
J4  27,27 180 top
J5  16.5,50 0 bottom
J6  9.5,56 0 top
J7  33.5,31 270 bottom
J8  47.5,31 90 bottom
L1  40.5,40 0 top
P1  16.5,20.5 90 top
P2  28.5,20.5 90 top
P3  24.5,20.5 90 top
P4  20.5,20.5 0 top
R1  15,28 0 top
R3  19,24 0 top
R4  15,24 0 top
R5  71.5,24 0 top
S1  4.5,11 90 top
S2  77,11 90 top
U2  14.5,37 90 top
U3  69,45 90 top
U4  51.5,44.5 270 top
U5  68.5,35.5 0 top
U$1  [700MAH-BATTERY]  77,-25.5 90 top  (outside the outline)
U$2  [QUADCLASS_LOGO_SMALL]  10.5,18.5 0 top
U$3  [LAYER_LABELS]  39.5,-12 0 top  (outside the outline)
U$4  [375MAH-BATTERY]  -31.5,32 0 top  (outside the outline)
U$5  [600MAH-BATTERY]  41.5,82 90 top  (outside the outline)
U$6  -114.5,-38 0 top  (outside the outline)
V1  11.5,39 180 top
V2  11.5,40 180 top
V3  12.5,35 0 top
V4  17.5,35 180 top
V5  15,35 0 top
V6  17.5,39 180 top
V7  10.5,35 180 top
V8  14.5,35 180 top
V23  13.5,39 180 top
V24  9.5,39 180 top
V26  12.5,39 180 top
V27  10.5,40 180 top
V28  10.5,39 180 top
V30  17.5,40 180 top
V31  18.5,39 180 top
V32  19.5,39 180 top
V33  15.5,39 180 top
V34  16.5,40 180 top
V35  11.5,35 180 top
V36  16.5,39 180 top
V37  16,35 180 top
V38  13.5,35 180 top
Y1  60,44 90 top

### Tracks (layer width: path | path; a pad name or v marks a point on that pad's centre or on a via)
3V3  (via drill 0.2)  (19 unrouted)
  Top 0.127: C4.2 v63,47.39 | S2.3 v74.65,13.5 | R3.8 v20.37,24.75 | U3.17 v64.29,47.92 | U3.4 v73.71,42.73 | C9.1 v74,35.38 | U4.23 v45.48,45.25 | U4.59 v57.52,45.75 | U4.54 v57.52,43.25 | U4.44 v53.25,38.48 | U4.34 v48.25,38.48 | R1.5 v16.37,27.25 | C16.1 v58.39,38.5 | C12.1 v44.62,41 | D4.A1 v11.7,13.73 | R5.6 v72.87,23.75 | R5.5 v73.61,23.25 | U5.16 v72.51,37.77
  Bottom 0.127: J5.VCC v17.77,52.57
  pour Route15 (rank 2): -5.5,64.49 32,64.49 32,58.5 50.5,58.5 50.5,51 56.5,51 56.5,58.5 58,58.5 58,64.5 86.5,64.5 86.5,-1.5 -5.5,-1.5
$N1  (via drill 0.2)
  Top 0.127: R1.4 13.25,27.25 13,27.5 13,33.75 14,34.75 14,37.5 14.5,38 14.5,40 14.75,40.25 | 14.75,40.25 14.75,40.75 14,41.5 6,41.5 J2.4 1.75,45 0.5,46.25 0.5,49.75 1.75,51 J2.1 | J3.4 79.25,35 80.5,33.75 80.5,30.25 79.25,29 J3.1 54.75,29 49.75,24 v49.75,23.75 | 14.75,40.25 15,40 15.75,40 16.25,39.5 17.75,39.5 19.25,41 27.25,41 v30,38.25
  Bottom 0.127: 35.25,32.25 35.25,35.5 33.5,37.25 33,37.25 J7.1 32.75,37.25 31,37.25 v30,38.25 | 35.25,32.25 35.25,30.5 34.5,29.75 33,29.75 J7.4 | 49.5,25 49.25,24.75 48.25,24.75 J8.1 49.5,25 | 49.5,25 49.5,25.75 50.5,26.75 50.5,30.5 48.75,32.25 48.25,32.25 J8.4 48,32.25 35.25,32.25 | v49.75,23.75 49.5,24 49.5,25
ANTENNA  (2 unrouted)
BAT_SENSE  (via drill 0.2)
  Top 0.127: R3.3 18.75,23.75 19,24 19,25 19.25,25.25 20.75,25.25 24,22 27,22 28.25,23.25 v28.25,25.75 | v49.5,43 49.5,44 52.75,47.25 U4.6 | R1.7 15.25,28.25 15,28.5 v15,29.25
  Route2 0.127: v28.25,25.75 28.25,26.5 28.5,26.75 33.25,26.75 v49.5,43
  Bottom 0.127: v15,29.25 24.75,29.25 v28.25,25.75
BCAP  (1 unrouted)
BPOS  (via drill 0.38)
  Top 0.508: U2.3 v16.84,37.95 | S1.2 v2.06,11 | B3.P v17.5,42.36 17.25,42.25 17.25,40.5 | 20,37 20,36.5 19.75,36.25 C6.1 | v1,19.75 5.25,24 5.25,27.5 8.5,30.75 8.5,36 7.75,36.75 7.75,40.5 8.25,41 13.75,41 v14.25,40.5 v14.24,40.5
  Route2 0.508: v14.24,40.5 15.5,39.24 V33.P1
  Bottom 0.508: v1,19.75 1,12.5 2,11.5 2,11 v2.06,11
  pour Top: 14,37 20,37 20,40.5 14,40.5
  pour Bottom (rank 2): 14,37 20,37 20,40.5 14,40.5
BTN1/SCL  (via drill 0.2)
  Top 0.127: U4.25 47.5,44.25 v50.75,41 | v56,28.5 54.75,28.5 50.25,24 50.25,23.25 49.25,22.25 49.25,18.5 45.5,14.75 33.5,14.75 33.25,14.5 B4.3
  Route2 0.127: v50.75,41 50.75,40 56,34.75 v56,28.5
BTN2/SDA  (via drill 0.2)
  Top 0.127: v45,43.75 U4.26 | v49.75,22 49.75,18.5 47,15.75 47,14.25 38,5.25 34,5.25 33.25,4.5 B5.3
  Bottom 0.127: v45,43.75 45,41.75 45.75,41 45.75,34.25 46.5,33.5 54.75,33.5 57.5,30.75 57.5,28.25 51.25,22 v49.75,22
BTN_CENTER  (via drill 0.2)
  Top 0.127: U4.53 57.5,42.75 v57.75,42.5 | v69.25,28.5 69.25,24.75 68.5,24 68.5,23.25 64.75,19.5 64.75,17.5 64,16.75 B9.1
  Bottom 0.127: v57.75,42.5 61.25,42.5 69.25,34.5 v69.25,28.5
BTN_DOWN  (via drill 0.2)
  Top 0.127: U4.28 48.5,42.75 49.75,41.5 v49.75,41 | v55,27.5 54.75,27.5 51.25,24 51.25,18.5 48.5,15.75 48.5,6 48.75,5.75 52.5,5.75 52.75,5.5 B10.2
  Route2 0.127: v49.75,41 50.25,40.5 50.25,40 55.5,34.75 55.5,30.25 55,29.75 v55,27.5
BTN_LEFT  (via drill 0.2)
  Top 0.127: v57.75,41.75 U4.51 | v62,28.5 62,28.25 61.75,28 61.75,21.75 63.75,19.75 63.75,18.25 63.5,18 51.25,18 50,16.75 B7.1
  Bottom 0.127: v57.75,41.75 57.75,40.25 59.75,38.25 59.75,37 61.75,35 61.75,28.75 v62,28.5
BTN_RIGHT  (via drill 0.2)
  Top 0.127: U4.52 55,42.25 54.75,42 v54.75,41.5 | v62.75,28.5 62.25,28 62.25,21.75 64.25,19.75 64.25,17.5 63.5,16.75 63.5,16 62.5,15 62.5,12.5 B8.1
  Route2 0.127: v54.75,41.5 54.75,36.5 v62.75,28.5
BTN_UP  (via drill 0.2)
  Top 0.127: U4.50 57.75,41.25 58,41 58,38.75 57.75,38.5 v59.25,37 | v61.25,28.5 61.25,21.75 63.25,19.75 63.25,19.5 B6.1
  Bottom 0.127: v59.25,37 61.25,35 v61.25,28.5
CLK_NEG
  Top 0.127: U4.56 59.52,44.25 Y1.1 60.95,40.7 C15.1
CLK_POS
  Top 0.127: U4.57 58.62,44.75 Y1.3 60.75,46.88 C14.1
CTS  (via drill 0.2)
  Top 0.127: v70.75,47.25 72.5,47.25 U3.11 | v69.75,47.5 69.75,41.25 68,39.5 68,37.5 67.75,37.25 65.75,37.25 U5.2
  Bottom 0.127: v70.75,47.25 70.5,47.5 v69.75,47.5
CTS-1  (via drill 0.2)
  Top 0.127: v62.25,36.25 62.25,36.5 63.5,37.75 65.5,37.75 U5.1
  Route15 0.127: v62.25,36.25 62,36.5 33.75,36.5 v30,40.25
  Bottom 0.127: v30,40.25 21.5,48.75 21.5,49 20.25,50.25 20.25,50.5 J5.CTS
DTR
  Top 0.127: U3.2 72.5,41.5 71,41.5 69,39.5 69,36.75 69.25,36.5 71.25,36.5 U5.14
DTR-0  (via drill 0.2)
  Top 0.127: v30,35 28.25,35 25.75,32.5 25.75,28.25 25,27.5 23,27.5 22.75,27.25 C1.2 | v70,37.5 70.25,37.25 71.25,37.25 U5.15
  Route2 0.127: v30,35 37.25,35 49.25,47 49.75,47 52.5,49.75 56.25,49.75 57.25,48.75 58.75,48.75 v70,37.5
DTR-1  (via drill 0.2)
  Top 0.127: v59.75,33.75 61.25,32.25 66.5,32.25 67.75,33.5 67.75,34 69.5,35.75 71.25,35.75 U5.13 | v42.5,51 42.5,50.75 38.5,46.75 13.25,46.75 11.5,48.5 10.75,48.5 | 10.75,48.5 10.75,47.25 J6.DTR 10.75,48.5 | 10.75,48.5 v9.75,48.5
  Bottom 0.127: v42.5,51 v59.75,33.75 | v9.75,48.5 10.25,49 10.25,50.5 J5.DTR
E1-A  (via drill 0.2)
  Top 0.127: U4.40 51.25,36.25 54.25,33.25 v54.25,33 | v50.75,22.5 50.75,18.5 48,15.75 48,5.25 43.25,0.5 40.25,0.5 38,2.75 E1.A
  Bottom 0.127: v54.25,33 54.25,31.5 56.5,29.25 56.5,27.75 51.25,22.5 v50.75,22.5
E1-B  (via drill 0.2)
  Top 0.127: U4.41 51.75,36.25 55,33 v55,32.5 | v57,28.5 56.75,28.5 56.25,28 54.75,28 50.75,24 50.75,23.25 50.25,22.75 50.25,18.5 47.5,15.75 47.5,14.25 43,9.75 E1.B
  Bottom 0.127: v55,32.5 55.25,32.5 57,30.75 v57,28.5
E1-BUT  (via drill 0.2)
  Top 0.127: U4.27 43.75,43.25 41.75,45.25 v41.75,45.5 | v40.25,21.5 v40.25,44.75
  Bottom 0.127: v41.75,45.5 41,44.75 v40.25,44.75 | v40.25,21.5 40.25,20.75 38,18.5 E1.BUTA
GND  (via drill 0.2)  (79 unrouted)
  Top 0.127: U4.10 50.75,50.25 50.25,50.75 | 48.97,52 49.67,51.3 49.7,51.3 50.25,50.75 | U4.11 50.25,50.75 | U4.7 52.25,50.45 52.82,51.02 54.52,51.02 55,51.5 55,52.09 54.88,52.22 54.59,52.22 | U4.55 57.75,43.75 58.35,43.15 58.35,41.39 C15.2 | U4.58 57.72,45.25 59.25,46.78 C14.2 | U4.20 v47.75,46.75 | U4.24 v47.75,44.75 | U4.61 v55.25,46.75 | U4.45 v53.75,40.75 | U4.35 v48.75,40.75 | U3.26 v66.4,42.08 | U3.25 v67.02,42.73 | U3.21 v66.4,45.33 | U3.18 v66.4,47.27 | U3.7 v71.6,44.67 | B7.3 v51.85,14.6 | B7.4 v51.85,7.4 | B3.G v19.5,46.15 | B3.G2 v21.7,47.85 | B3.G3 v15.3,47.85 | J1.8 v71.8,54.37 | J1.10 v69.2,54.37 | J1.9 66.8,54.5 | 66.8,54.5 v66.8,54.37 | J1.11 v64.2,54.37 | B6.4 v56.05,16.5 | B6.3 v60.95,16.5 | J4.6 v24.46,26.39 | B10.4 v56.05,2.5 | B10.3 v60.95,2.5 | B8.4 v56.05,9.5 | B8.3 v60.95,9.5 | S2.1 v76.95,8.5 | B1.3 v17.85,14.6 | B1.4 v17.85,7.4 | B9.3 v65.85,14.6 | B9.4 v65.85,7.4 | L1.GND2 v48.5,55.33 | B5.2 v25.05,7.5 | B5.1 v29.95,7.5 | U2.2 v14.85,37 | B4.2 v25.05,17.5 | B4.1 v29.95,17.5 | U5.8 v66.77,33.23 | R5.1 v70.13,24.75 | R5.2 v69.39,24.25 | C12.2 v41.38,41 | C16.2 v61.61,38.5 | C9.2 v74,38.62 | R3.4 v17.63,23.25 | J6.GND v6.29,47.19 | C4.1 v63,50.61 | C5.2 v11,38.62 | C6.2 v18,38.62 | R4.1 v13.63,24.75 | R4.2 v12.89,24.25 | C8.2 v63,42.62 | C11.2 v41.38,47 | D1.C1 v11.7,6.27 | C13.2 v61.61,49.5 | R1.3 v13.63,27.75 | 66.8,54.5 66.7,54.4 J1.5
  Bottom 0.127: J5.GND v22.85,48.7 | J7.3 v34.8,32.27 | J7.6 v34.8,24.65 | J8.3 v46.2,29.73 | J8.6 v46.2,37.35
  pour Bottom: 20,36.5 8.5,36.5 8.5,34 20,34
  pour Top (rank 2): 32,64 -5,64 -5,-1 86,-1 86,64 58,64 58,58.5 56.5,58.5 56.5,50 47,50 47,54 50.5,54 50.5,58.5
  pour Route2: 32,65 32,58.5 58,58.5 58,65 87,65 87,-2 -6,-2 -6,65
  pour Bottom (rank 4): 32,65.5 -6.5,65.5 -6.5,-2.5 87.5,-2.5 87.5,65.5 58,65.5 58,58.5 56.5,58.5 56.5,51 50.5,51 50.5,58.5 32,58.5
  pour Top: 56,50.5 56,56 51,56 51,53.5 47.5,53.5 47.5,50.5
LCD_RX  (via drill 0.2)
  Top 0.127: v35.75,47.75 35.75,57.5 L1.RXI | v43,40 43.25,39.75 44.25,39.75 45.25,40.75 U4.32
  Bottom 0.127: v35.75,47.75 35.75,47.25 v43,40
LCD_TX  (via drill 0.2)
  Top 0.127: v39,48.5 38.25,49.25 38.25,54.25 L1.TX0 | v41.25,46.25 41.25,45.25 45.25,41.25 U4.31
  Bottom 0.127: v41.25,46.25 v39,48.5
MISO  (via drill 0.2)
  Top 0.127: U4.39 50.75,37.5 50,36.75 45.5,36.75 43.25,39 v43.25,39.25 | v30.25,36.75 30.5,36.5 30.5,32.75 29.5,31.75 29.5,29.75 J4.1
  Bottom 0.127: v43.25,39.25 42.75,38.75 29.75,38.75 29.5,38.5 29.5,37.5 v30.25,36.75
MOSI  (via drill 0.2)
  Top 0.127: v50.25,37.75 U4.38 | v28.75,26.25 28.5,26.5 27.25,26.5 27,26.25 J4.4
  Route2 0.127: v50.25,37.75 38.75,26.25 v28.75,26.25
N$1  (via drill 0.2)
  Top 0.127: v15,21.75 14.5,22.25 14.5,23.25 R4.4 | v15.5,16.25 15.25,16.25 14.75,15.75 14.75,13 11,9.25 11,7.75 D1.A1
  Bottom 0.127: v15,21.75 14,20.75 14,17.75 v15.5,16.25
N$2  (via drill 0.2)
  Top 0.127: v13.25,23.75 R4.3 | v8.25,18.75 8,18.75 6.25,17 6.25,15.75 4.5,14 4.5,10.5 5.25,9.75 6.25,9.75 9.5,6.5 10,6.5 D1.C2
  Bottom 0.127: v8.25,18.75 v13.25,23.75
N$3
  Top 0.127: R5.3 69.5,23.75 69.5,23.25 69.25,23 69.25,11.25 70.5,10 70.5,7.25 70.75,7 71.75,7 72,7.25 72,7.5 D5.A1
N$4
  Top 0.127: R5.8 73.75,24.75 74.75,23.75 74.75,14.5 73,12.75 73,12 71.25,10.25 71,10.5 71,12.25 D6.C2
N$5
  Top 0.127: R5.7 73.75,24.25 74.25,23.75 74.25,14.5 72,12.25 D6.C1
N$6  (via drill 0.2)
  Top 0.127: R4.7 17,24.25 17,22.75 v15.5,21.25 | v14.5,20.25 12.5,18.25 12,18.25 10.75,17 10.75,16 12.25,14.5 12.25,13 11.25,12 11,12 10.75,12.25 D4.C1
  Bottom 0.127: v14.5,20.25 v15.5,21.25
N$7
  Top 0.127: R5.4 70,23.25 69.75,23 69.75,11.25 71,10 71,7.75 D5.A2
N$8  (via drill 0.2)
  Top 0.127: v70,28.5 69.75,28.25 69.75,26.75 71.5,25 71.5,23 71,22.5 71,13.75 D6.A2 | v49.25,47.5 49,47.5 48.75,47.75 U4.14
  Bottom 0.127: v70,28.5 69.75,28.75 69.75,34.5 65.25,39 65.25,40 63.25,42 62.25,42 56.75,47.5 v49.25,47.5
N$9  (via drill 0.2)
  Top 0.127: v71.5,22.25 72,21.75 72,13.75 D6.A1 | v49,45.75 49.25,46 49.25,46.75 48.25,47.75 U4.15
  Route2 0.127: v71.5,22.25 71.5,22.75 69.5,24.75 69.5,27.25 70.5,28.25 70.5,28.75 65.25,34 65.25,40 63.25,42 63,42 56.5,48.5 56.5,49 56.25,49.25 52.5,49.25 v49,45.75
N$11  (via drill 0.2)
  Top 0.127: R4.5 16.5,23.25 v16.5,23.75 R4.6 | v16.5,28.5 17,29 17,35 16.25,35.75 16.25,36 16,36.25 U2.1
  Bottom 0.127: v16.5,23.75 16.5,26 15.5,27 15.5,27.5 v16.5,28.5
N$12
  Top 0.127: R1.6 15.25,27.75 15,27.5 15,27 14.75,26.75 13.25,26.75 12.5,27.5 12.5,34.25 13,34.75 13,35.25 13.5,35.75 13.5,36 13.25,36.25 U2.5
N$13  (via drill 0.2)
  Top 0.127: v15,25.25 15.5,24.75 R4.8 | v9.25,18.25 9.25,18 10.25,17 10.25,16 9,14.75 9,12.75 9.75,12 10,12 10.25,12.25 D4.C2
  Bottom 0.127: v15,25.25 15,24 v9.25,18.25
N$14
  Top 0.127: D2.2 10.5,20.25 8.5,18.25 8,18.25 6.75,17 6.75,13.75 6.5,13.5 S1.7
N$20
  Top 0.127: C11.1 43.75,45.75 44,45.5 44.25,45.5 44.5,45.75 U4.22 48.25,45.75 48.5,46 48.25,46.25 U4.21
PITCH  (via drill 0.2)
  Top 0.127: U4.2 54.75,44.5 v51.5,41.25
  Bottom 0.127: v51.5,41.25 51.5,37.75 51.25,37.5 | 51.25,37.5 48.5,34.75 48.25,34.75 J8.V | J3.V 78.25,31 75.25,28 60.75,28 51.25,37.5
PROG_SEL  (via drill 0.2)
  Top 0.127: 73.75,34.75 74,34.75 75.25,36 75.25,48.25 73.25,50.25 72.25,50.25 70.25,48.25 70.25,41.25 68.5,39.5 68.5,37.5 68.25,37.25 68.25,36.25 67.75,35.75 65.75,35.75 U5.4 | 73.75,34.75 73.25,35.25 71.5,35.25 U5.12 | S2.2 76.5,11 76.5,12.5 77,13 77,14 75.25,15.75 75.25,23.75 73.75,25.25 v73.75,28.5 | v73.25,34.5 73.5,34.5 73.75,34.75
  Bottom 0.127: v73.75,28.5 73.75,34 v73.25,34.5
RESET  (via drill 0.2)
  Top 0.127: R3.1 17,24.75 v17,25.25 | v17,26.75 17,28.5 17.25,28.75 C1.1 | U4.12 49.75,45.75 v48.25,44.25 | v37.75,46.25 37.75,46 30.5,38.75 30.5,37.75 24.5,31.75 24.5,29.75 J4.5 24.5,29.5 24.5,29 24.25,28.75 C1.1 | C1.1 | B1.1 16,17 17.25,18.25 v17.5,18.25
  Bottom 0.127: v17,26.75 v17,25.25 17,23.25 17.75,22.5 17.75,20 17.5,19.75 v17.5,18.25 | v48.25,44.25 39.75,44.25 v37.75,46.25
RF  (via drill 0.2)
  Top 0.127: v10.5,15.5 10.25,15.5 10,15.25 10,13.75 D4.A2 | v42,48 42,48.25 43.75,50 47,50 47.25,49.75 47.75,49.75 U4.16
  Route2 0.127: v10.5,15.5 10.5,18.5 16.75,24.75 17.5,24.75 21.75,29 23.5,29 26,31.5 26,33.25 40.75,48 v42,48
RF_N  (1 unrouted)
  Top 0.152: U4.9 51.25,50.73 52.38,51.85
RF_P  (1 unrouted)
  Top 0.152: U4.8 51.75,50.41 52.63,51.28 53.41,51.28 53.98,51.85
ROLL  (via drill 0.2)
  Top 0.127: U4.1 55.25,50.25 57.75,50.25 58.75,51.25 64,51.25 v65.25,50 | v55.5,29.5 71,29.5 J3.H
  Bottom 0.127: v65.25,50 78.25,37 J3.H | v55.5,29.5 55.5,28.75 50,23.25 46.75,23.25 45.75,24.25 45.75,25 46.75,26 46.75,27 47,27.25 48,27.25 J8.H
RXI  (via drill 0.2)
  Top 0.127: v74.75,43.5 72.75,43.5 U3.5 | v75.75,43.5 75.75,36 74,34.25 73.75,34.25 73.5,34 71.5,34 U5.10
  Bottom 0.127: v75.75,43.5 v74.75,43.5
RXI-0  (via drill 0.2)
  Top 0.127: U4.47 54.75,37.75 56.25,36.25 59.5,36.25 60.25,37 v60.25,37.25 | v68.25,33.75 69.25,33.75 70,34.5 71.25,34.5 U5.11
  Bottom 0.127: v60.25,37.25 60.25,37 63.5,33.75 v68.25,33.75
RXI-1  (via drill 0.2)
  Top 0.127: v56.5,30 64.75,30 68,33.25 71.25,33.25 U5.9 | v54.75,31.75 53.75,32.75 53.75,33.25 50.75,36.25 45.5,36.25 42,39.75 41.25,39.75 40.75,40.25 40.75,47.5 46.5,53.25 46.5,58.5 46.25,58.75 34.25,58.75 31.25,55.75 13.25,55.75 11.5,54 | 11.5,54 10.75,53.25 10.75,51.25 J6.RXI | 11.5,54 v12.75,52.75
  Bottom 0.127: v54.75,31.75 v56.5,30 | v12.75,52.75 12.75,50.75 J5.RXI
RXLED  (via drill 0.2)
  Top 0.127: v69,23.75 69,23.25 68.75,23 68.75,11.25 70,10 70,7.25 70.75,6.5 71,6.5 D5.C2 | v64.75,39.75 63.75,40.75 63.75,43.75 64.25,44.25 64.25,44.5 64.5,44.75 65.25,44.75 U3.22
  Route2 0.127: v69,23.75 69,24 68.75,24.25 68.75,24.75 69,25 69,28 64.75,32.25 v64.75,39.75
SCK  (via drill 0.2)
  Top 0.127: U4.37 49.75,37.5 49.5,37.25 47,37.25 45.5,38.75 v44.5,38.75 | v30,27.25 29.5,27.25 29.25,27.5 27.25,27.5 27,27.75 J4.3
  Route2 0.127: v44.5,38.75 44.5,38.5 33.25,27.25 v30,27.25
THROTTLE  (via drill 0.2)
  Top 0.127: v56,48.75 56.25,48.5 56.25,48.25 U4.64 | J2.V 4,47.5 4,44 6,42 14,42 15,41 16.25,41 v16.5,40.75
  Route2 0.127: v39,31.75 v56,48.75
  Bottom 0.127: v39,31.75 39,31.5 34.75,27.25 33,27.25 J7.V 32.75,27.25 32.25,27.25 19.5,40 18.25,40 17.5,40.75 v16.5,40.75
TXLED  (via drill 0.2)
  Top 0.127: v75,28.5 76,28.5 80.5,24 80.5,8.25 78.75,6.5 72,6.5 D5.C1 | v67,43.5 66.5,44 65.5,44 U3.23
  Bottom 0.127: v75,28.5 74.25,29.25 74.25,34 73.75,34.5 73.75,34.75 67.5,41 67.5,43 v67,43.5
TXO  (via drill 0.2)
  Top 0.127: v69.5,37 69.5,39.5 70.75,40.75 72.5,40.75 U3.1 | v68.75,36.25 68.75,35.5 67.75,34.5 65.75,34.5 U5.6
  Bottom 0.127: v68.75,36.25 v69.5,37
TXO-0  (via drill 0.2)
  Top 0.127: U4.46 54.25,37.75 56.25,35.75 v58.75,35.75 | v60.25,34.25 63.25,34.25 63.5,34 65.5,34 U5.7
  Bottom 0.127: v60.25,34.25 v58.75,35.75
TXO-1  (via drill 0.2)
  Top 0.127: v60.75,34.75 61.25,35.25 65.5,35.25 U5.5 | v43.5,52 42.75,52 42,51.25 42,50.75 38.5,47.25 14.5,47.25 | 14.5,47.25 13.25,47.25 11.5,49 10,49 9.5,49.5 8.5,49.5 8.25,49.75 8.25,51 J6.TXO | 14.5,47.25 v14.5,47.75
  Bottom 0.127: v43.5,52 v60.75,34.75 | v14.5,47.75 15.25,48.5 15.25,50.5 J5.TXO
USB_D_N
  Top 0.152: U3.16 66.53,48.58 68.5,50.54 68.5,51.74 68.65,51.89 J1.2
USB_D_P
  Top 0.152: U3.15 66.44,49.23 66.53,49.14 66.7,49.14 68.22,50.66 68.22,51.74 68,51.96 J1.3
VBAT  (via drill 0.38)
  Top 0.127: v20.5,23.74 R3.6
  Top 0.508: S1.3 v2.06,13.5 1.25,13.5 0.75,14 0.75,18.5 5.25,23 7.25,23 D3.2 | v7.5,22.02 D3.2 | D3.2 8.17,22.98 v9,23.8
  Route15 0.508: v9,23.8 12.34,23.8 13.5,22.64 17.88,22.64 18.98,23.74 v20.5,23.74
VBUS  (via drill 0.38)
  Top 0.127: v20.5,22.98 19.89,22.98 R3.5
  Top 0.508: S1.6 v6.94,11 7.75,11 8,11.25 10,9.25 | v9.21,7.73 D1.A2 10,7.75 10,9.25 | U2.4 v12.16,37.95 | J1.1 v69.3,51.88 69.25,51.75 69.25,50.5 67.75,49 67.75,41.25 65.5,39 64,39 45,20 29.75,20 28.5,18.75 18.25,18.75 17.62,19.38 | 9.25,36.25 C5.1 | 8.5,37 9.25,36.25 | P1.T 17.62,19.38 | 9.25,36.25 9.25,30.5 6,27.25 6,24.75 6.25,24.5 11.25,24.5 15.25,20.5 P1.T | 17.62,19.38 14.25,16 14.25,13.25 10.25,9.25 10,9.25 | P1.T 17,21 v17,21.5
  Route2 0.508: v17,21.5 17.51,22.01 18.15,22.01 19.12,22.98 v20.5,22.98
  pour Top: 13.5,37 8.5,37 8.5,40.5 13.5,40.5
  pour Bottom: 13.5,37 8.5,37 8.5,40.5 13.5,40.5
VIN
  Top 0.508: U3.20 65.25,46 64.5,46 64,45.5 64,45 63.75,44.75 63.75,44.5 63.5,44.25 C7.1 63.25,44.25 63.25,43.75 62,42.5 62,41 62.25,40.75 62.25,40.25 C8.1 63,39 44.75,20.75 28.75,20.75 P2.T 28.5,21.25 29.5,22.25 29.5,24.25 J4.2 29.5,24.5 29.5,25.75 29.88,26.12 | D3.1 7.5,26 10.5,26 D2.1 10.75,26 19.5,26 20.25,26.75 23,26.75 23.25,27 29,27 29.88,26.12 | 29.88,26.12 31,27.25 31,38.5 46,53.5 46,57.5 L1.RAW
YAW  (via drill 0.2)
  Top 0.127: U4.63 57.5,47.75 57.75,48 v57.75,48.25
  Bottom 0.127: v57.75,48.25 57.5,48 48,48 44,52 44,52.25 43.75,52.5 39.75,52.5 35.25,48 35.25,44.75 29,38.5 | 29,38.5 29,37.5 29.75,36.75 29.75,36 31,34.75 32.75,34.75 J7.H | J2.H 2.75,43 4.5,41.25 26.25,41.25 29,38.5

### Text on the board
tPlace: CSE176e / Remote | B | G | Ignore four drills outside of board area | Ignore four drills outside of board area | TX | RX | O | Y | B | G | GND | DTR | Steven / Swanson | VBUS | GND | 3V3 | VIN | ON | QUAD | RX/TX | PWR | STATUS | BTN1 | FTDI RX | FTDI TX | CHARGE | DONE | OFF | RST | RC | BTN2 | Mark IV | Rev 9
Document: Mounting w/o LCD: / 1.6mm controller board / 9mm standoff (3x donuts) / 3mm baseplate / 1.6mm runout / 15.2mm total / ~5/8in total | Mounting w/ LCD: / 1.6mm LCD / 12mm standoff (4x) / 1.6mm controller board / 9mm standoff (3x donuts) / 3mm baseplate / 1.6mm nut / 28.8 mm total / ~1 1/4 in | B and G on top / O and Y below | Mounting gimbals: / 1in standoffs.
baseplateart: CSE176e | <--THROTTLE--> | <--PITCH--> | To achieve great things, two things are needed: a plan and not quite enough time. / --Leonard Bernstein | <--YAW--> | <--ROLL-->